# EAGLE schematic KramerMC_CPU_ferryTALE2020 (EAGLE 6.6.0)

## Sheet 1 of 2
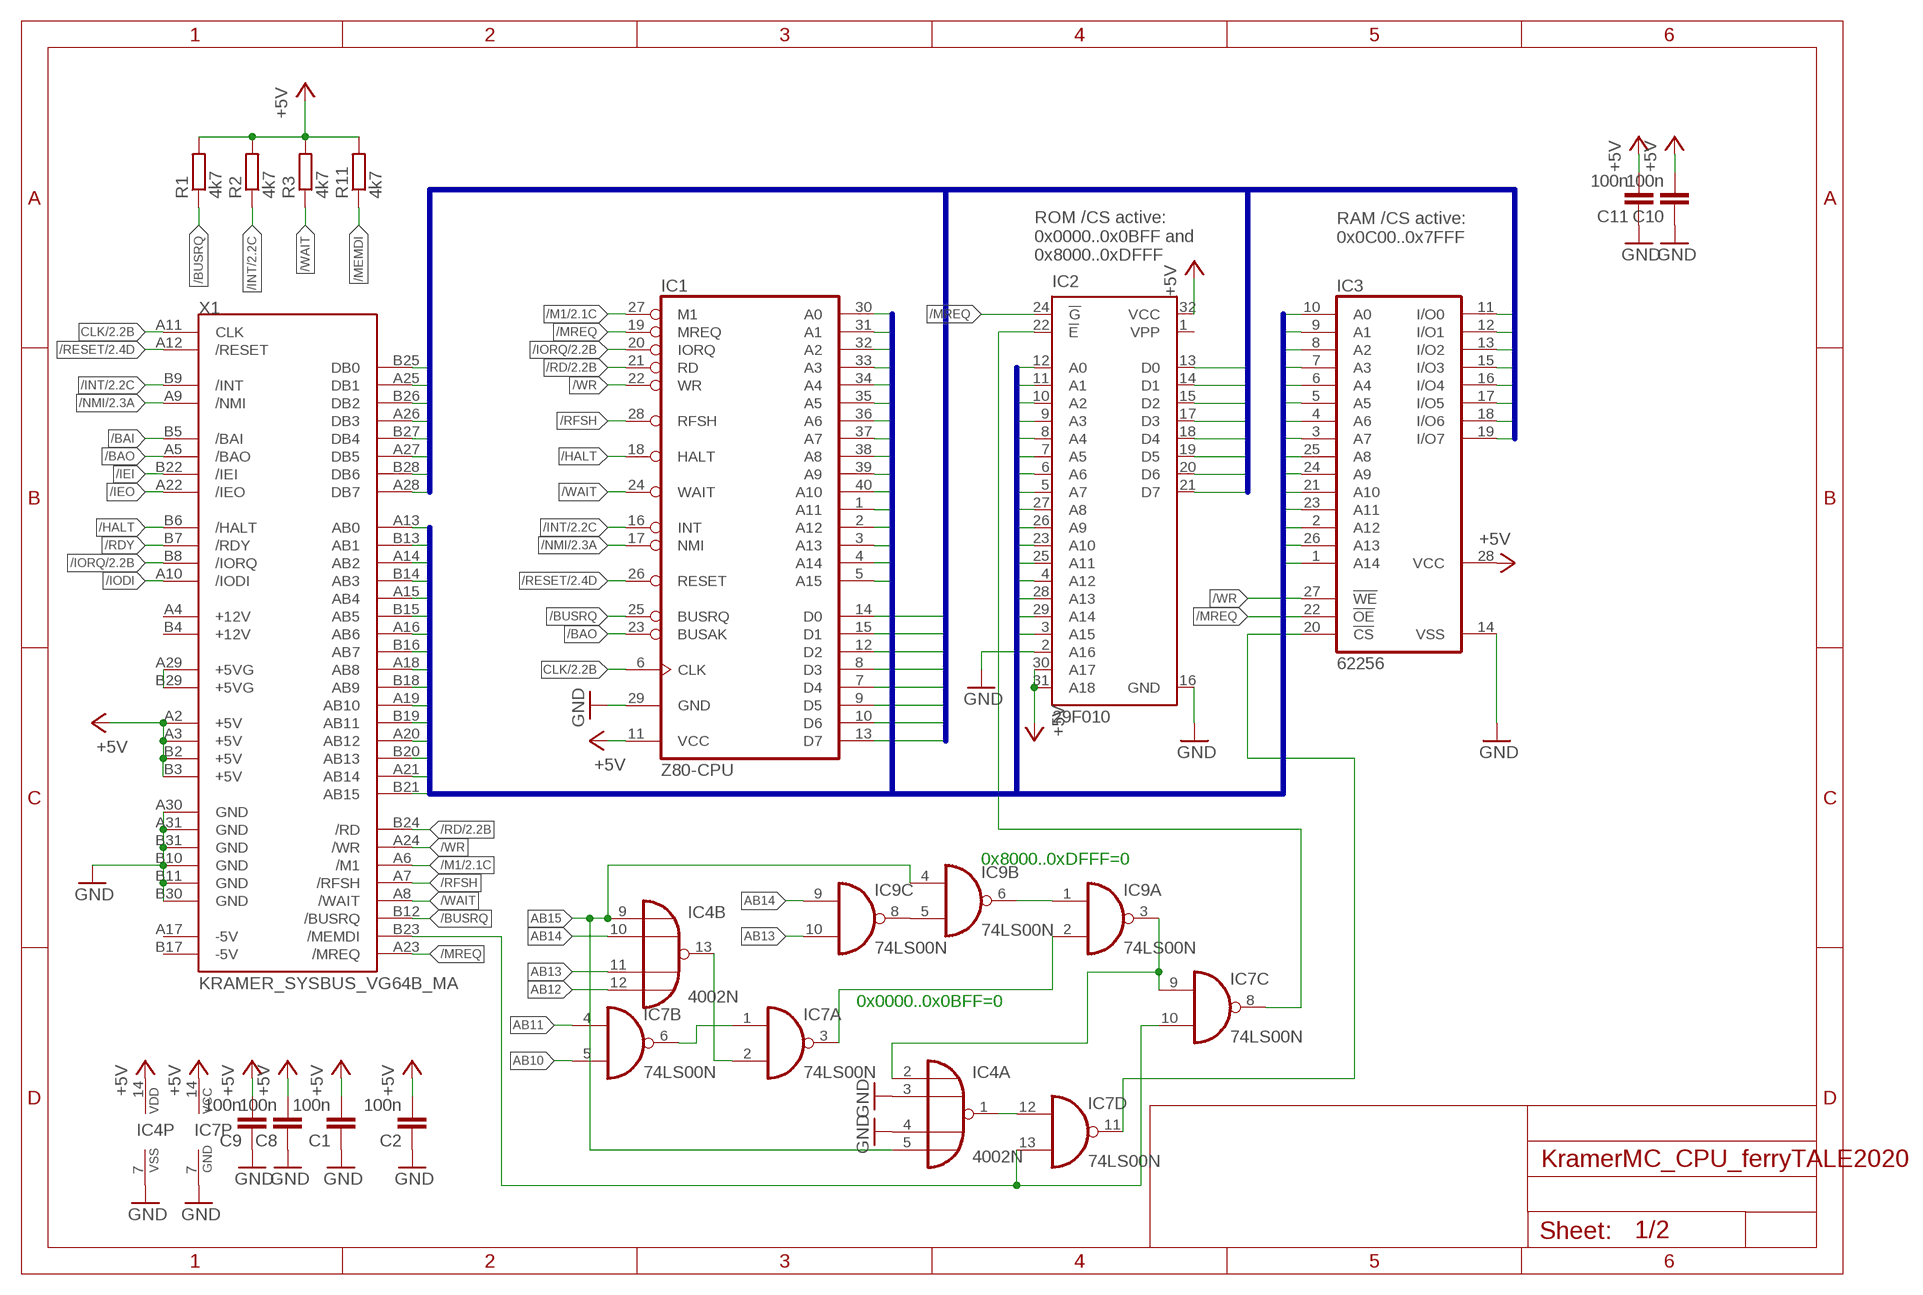
[diagram p0: schematic, sheet 1]

### Parts
C1  100n  C-EUC0603_NEW  [C0603_NEW]
C2  100n  C-EUC0603_NEW  [C0603_NEW]
C8  100n  C-EU050-025X075  [C050-025X075]
C9  100n  C-EU050-024X044  [C050-024X044]
C10  100n  C-EU050-024X044  [C050-024X044]
C11  100n  C-EUC0603_NEW  [C0603_NEW]
IC1  Z80-CPU  Z80CPU  [DIL40]
IC2  29F010  M27C4001B  [DIL32]
IC3  62256  62256P  [DIL28-6]
IC4  4002N  [DIL14]
IC7  74LS00N  [DIL14]
IC9  74LS00N  [DIL14]
R1  4k7  R-EU_R0603_NEW  [R0603_NEW]
R2  4k7  R-EU_0207/10  [0207/10]
R3  4k7  R-EU_R0603_NEW  [R0603_NEW]
R11  4k7  R-EU_R0805_WIDE  [R0805_WIDE]
X1  KRAMER_SYSBUS_VG64B_MA  [MAB64]

### Nets
+5V: C1.2 C2.2 C8.2 C9.2 C10.2 C11.2 IC1.11(VCC) IC2.30(A17) IC2.31(A18) IC2.32(VCC) IC3.28(VCC) IC4.14(P:VDD) IC7.14(P:VCC) R1.2 R2.2 R3.2 R11.2 X1.A2(+5V) X1.A3(+5V) X1.B2(+5V) X1.B3(+5V) ; also sheet 2
+5VG: X1.A29(+5VG) X1.B29(+5VG)
/BAI: X1.B5(/BAI)
/BAO: IC1.23(BUSAK) X1.A5(/BAO)
/BUSRQ: IC1.25(BUSRQ) R1.1 X1.B12(/BUSRQ)
/HALT: IC1.18(HALT) X1.B6(/HALT)
/IEI: X1.B22(/IEI)
/IEO: X1.A22(/IEO)
/INT: IC1.16(INT) R2.1 X1.B9(/INT) ; also sheet 2
/IODI: X1.A10(/IODI)
/IORQ: IC1.20(IORQ) X1.B8(/IORQ) ; also sheet 2
/M1: IC1.27(M1) X1.A6(/M1) ; also sheet 2
/MEMDI: IC7.10(C:I1) IC7.13(D:I1) R11.1 X1.B23(/MEMDI)
/MREQ: IC1.19(MREQ) IC2.24(!G) IC3.22(!OE) X1.A23(/MREQ)
/NMI: IC1.17(NMI) X1.A9(/NMI) ; also sheet 2
/RD: IC1.21(RD) X1.B24(/RD) ; also sheet 2
/RDY: X1.B7(/RDY)
/RESET: IC1.26(RESET) X1.A12(/RESET) ; also sheet 2
/RFSH: IC1.28(RFSH) X1.A7(/RFSH)
/WAIT: IC1.24(WAIT) R3.1 X1.A8(/WAIT)
/WR: IC1.22(WR) IC3.27(!WE) X1.A24(/WR)
AB0: IC1.30(A0) IC2.12(A0) IC3.10(A0) X1.A13(AB0) ; also sheet 2
AB1: IC1.31(A1) IC2.11(A1) IC3.9(A1) X1.B13(AB1) ; also sheet 2
AB2: IC1.32(A2) IC2.10(A2) IC3.8(A2) X1.A14(AB2)
AB3: IC1.33(A3) IC2.9(A3) IC3.7(A3) X1.B14(AB3)
AB4: IC1.34(A4) IC2.8(A4) IC3.6(A4) X1.A15(AB4)
AB5: IC1.35(A5) IC2.7(A5) IC3.5(A5) X1.B15(AB5)
AB6: IC1.36(A6) IC2.6(A6) IC3.4(A6) X1.A16(AB6) ; also sheet 2
AB7: IC1.37(A7) IC2.5(A7) IC3.3(A7) X1.B16(AB7) ; also sheet 2
AB8: IC1.38(A8) IC2.27(A8) IC3.25(A8) X1.A18(AB8)
AB9: IC1.39(A9) IC2.26(A9) IC3.24(A9) X1.B18(AB9)
AB10: IC1.40(A10) IC2.23(A10) IC3.21(A10) IC7.5(B:I1) X1.A19(AB10)
AB11: IC1.1(A11) IC2.25(A11) IC3.23(A11) IC7.4(B:I0) X1.B19(AB11)
AB12: IC1.2(A12) IC2.4(A12) IC3.2(A12) IC4.12(B:I3) X1.A20(AB12)
AB13: IC1.3(A13) IC2.28(A13) IC3.26(A13) IC4.11(B:I2) IC9.10(C:I1) X1.B20(AB13)
AB14: IC1.4(A14) IC2.29(A14) IC3.1(A14) IC4.10(B:I1) IC9.9(C:I0) X1.A21(AB14)
AB15: IC1.5(A15) IC2.3(A15) IC4.5(A:I3) IC4.9(B:I0) IC9.4(B:I0) X1.B21(AB15)
CLK: IC1.6(CLK) X1.A11(CLK) ; also sheet 2
DB0: IC1.14(D0) IC2.13(D0) IC3.11(I/O0) X1.B25(DB0) ; also sheet 2
DB1: IC1.15(D1) IC2.14(D1) IC3.12(I/O1) X1.A25(DB1) ; also sheet 2
DB2: IC1.12(D2) IC2.15(D2) IC3.13(I/O2) X1.B26(DB2) ; also sheet 2
DB3: IC1.8(D3) IC2.17(D3) IC3.15(I/O3) X1.A26(DB3) ; also sheet 2
DB4: IC1.7(D4) IC2.18(D4) IC3.16(I/O4) X1.B27(DB4) ; also sheet 2
DB5: IC1.9(D5) IC2.19(D5) IC3.17(I/O5) X1.A27(DB5) ; also sheet 2
DB6: IC1.10(D6) IC2.20(D6) IC3.18(I/O6) X1.B28(DB6) ; also sheet 2
DB7: IC1.13(D7) IC2.21(D7) IC3.19(I/O7) X1.A28(DB7) ; also sheet 2
GND: C1.1 C2.1 C8.1 C9.1 C10.1 C11.1 IC1.29(GND) IC2.2(A16) IC2.16(GND) IC3.14(VSS) IC4.3(A:I1) IC4.4(A:I2) IC4.7(P:VSS) IC7.7(P:GND) X1.A30(GND) X1.A31(GND) X1.B10(GND) X1.B11(GND) X1.B30(GND) X1.B31(GND) ; also sheet 2
N$1: IC3.20(!CS) IC7.11(D:O)
N$2: IC7.3(A:O) IC9.2(A:I1)
N$3: IC2.22(!E) IC7.8(C:O)
N$4: IC9.5(B:I1) IC9.8(C:O)
N$5: IC9.1(A:I0) IC9.6(B:O)
N$6: IC4.2(A:I0) IC7.9(C:I0) IC9.3(A:O)
N$7: IC4.13(B:O) IC7.2(A:I1)
N$8: IC7.1(A:I0) IC7.6(B:O)
N$186: IC4.1(A:O) IC7.12(D:I0)
Unconnected: X1.A4(+12V) X1.A17(-5V) X1.B4(+12V) X1.B17(-5V)

### Buses
DB
AB

### Notes on the sheet
- RAM /CS active:
  0x0C00..0x7FFF
- ROM /CS active:
  0x0000..0x0BFF and
  0x8000..0xDFFF
- 0x8000..0xDFFF=0
- 0x0000..0x0BFF=0

## Sheet 2 of 2
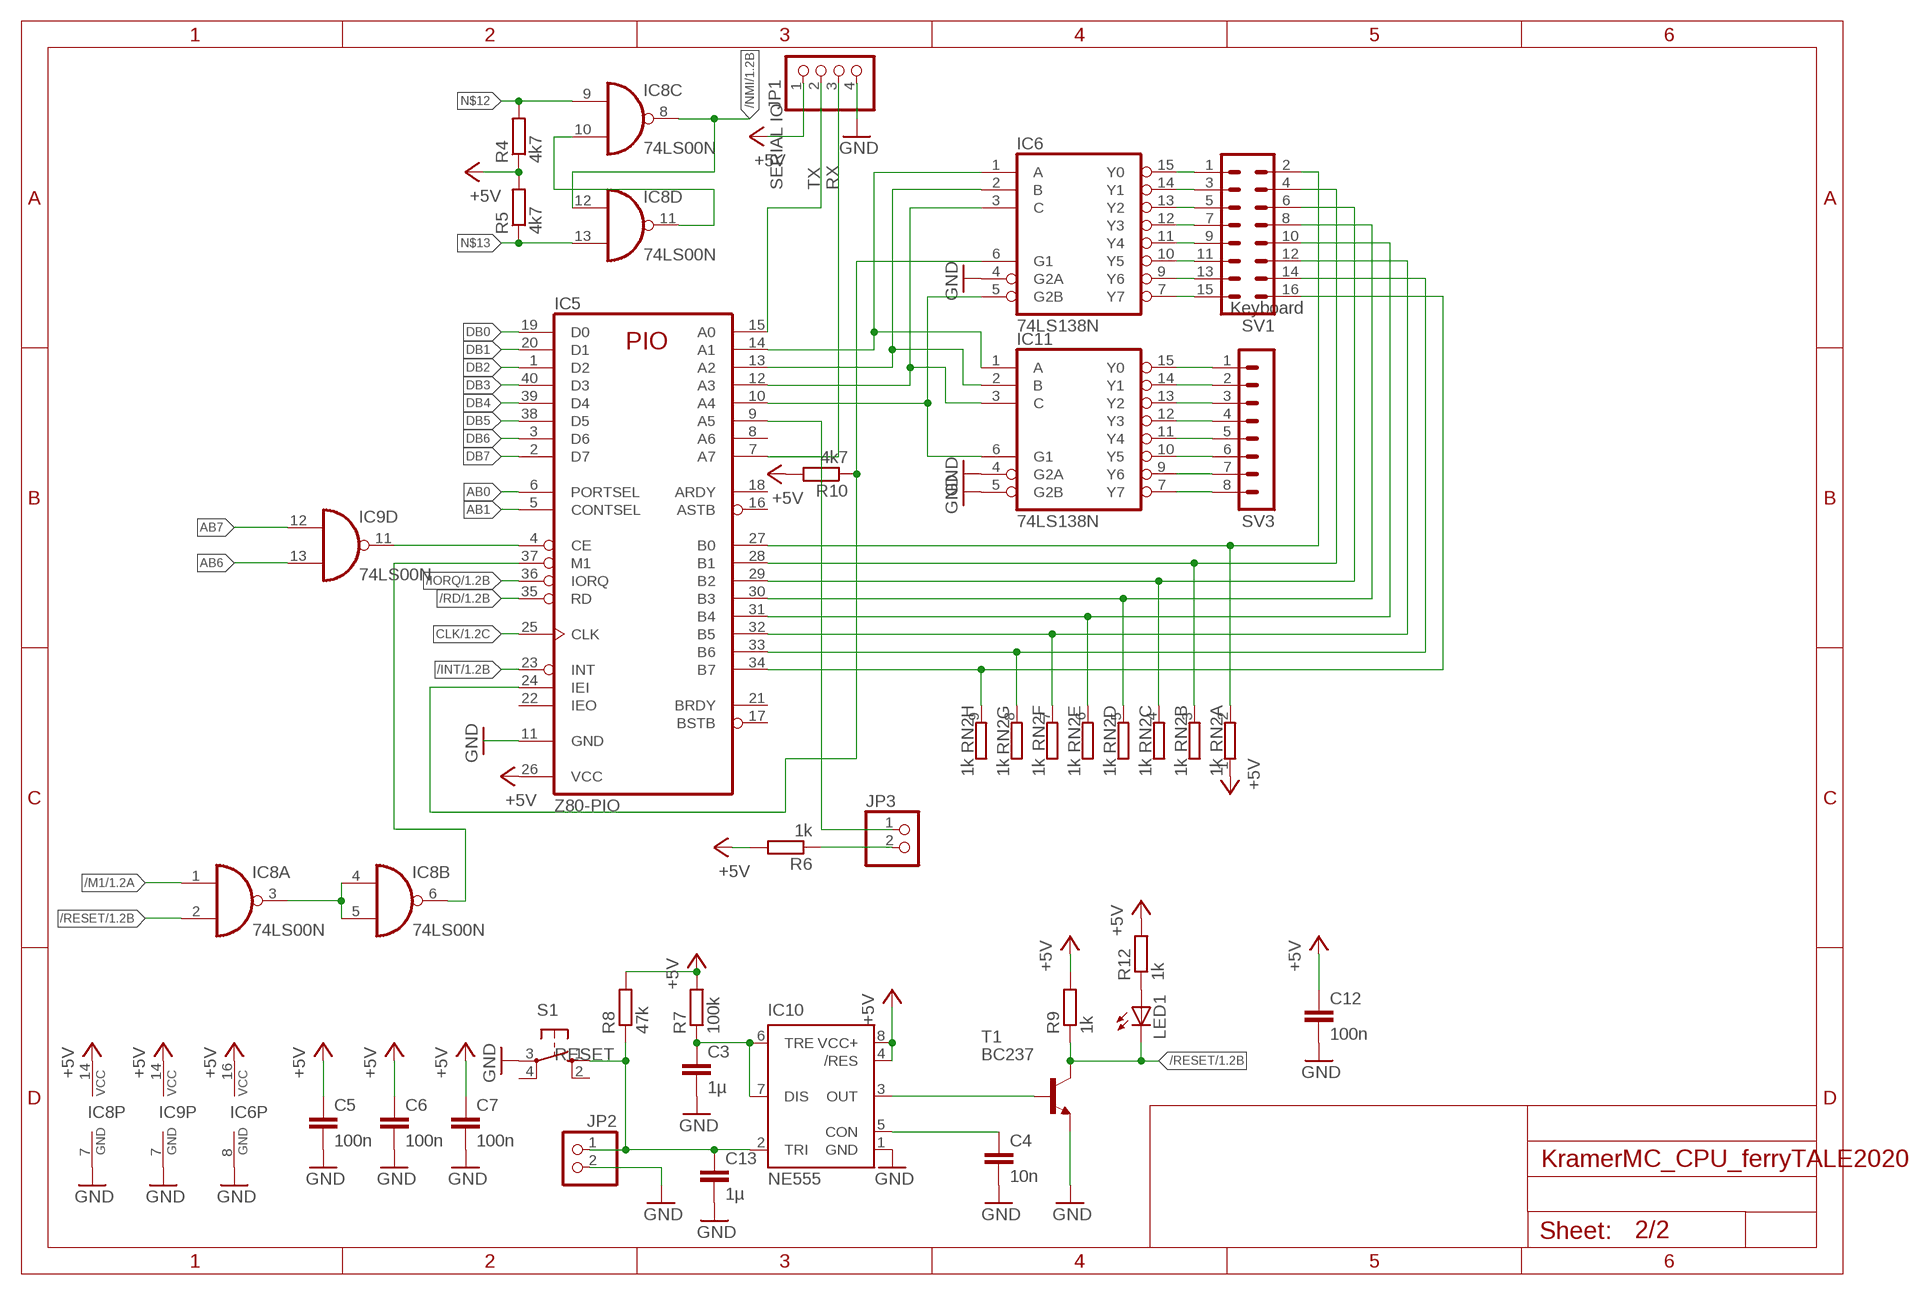
[diagram p1: schematic, sheet 2]

### Parts
C3  1µ  C-EUC0603_NEW  [C0603_NEW]
C4  10n  C-EUC0805  [C0805]
C5  100n  C-EUC0603_NEW  [C0603_NEW]
C6  100n  C-EUC0603_NEW  [C0603_NEW]
C7  100n  C-EUC0603_NEW  [C0603_NEW]
C12  100n  C-EUC0603_NEW  [C0603_NEW]
C13  1µ  C-EUC0603_NEW  [C0603_NEW]
IC5  Z80-PIO  Z80PIO  [DIL40]
IC6  74LS138N  [DIL16]
IC8  74LS00N  [DIL14]
IC10  NE555  [DIL-08]
IC11  74LS138N  [DIL16]
JP1  PINHD-1X4/90  [1X04/90]
JP2  PINHD-1X2/90  [1X02/90]
JP3  PINHD-1X2/90  [1X02/90]
LED1  LED3MM  [LED3MM]
R4  4k7  R-EU_R0805  [R0805]
R5  4k7  R-EU_R0805  [R0805]
R6  1k  R-EU_0207/10  [0207/10]
R7  100k  R-EU_R0603_NEW  [R0603_NEW]
R8  47k  R-EU_R0805  [R0805]
R9  1k  R-EU_R0603_NEW  [R0603_NEW]
R10  4k7  R-EU_0207/7  [0207/7]
R12  1k  R-EU_R0603_NEW  [R0603_NEW]
RN2  1k  GE08R  [SIL9]
S1  10-XX  [B3F-10XX]
SV1  MA08-2W  [MA08-2W]
SV3  MA08-1W  [MA08-1W]
T1  BC237  [TO92]

### Nets
+5V: C5.1 C6.1 C7.1 C12.1 IC5.26(VCC) IC6.16(VCC) IC8.14(P:VCC) IC9.14(P:VCC) IC10.4(/RES) IC10.8(VCC+) JP1.1 R4.1 R5.2 R6.2 R7.2 R8.2 R9.2 R10.2 R12.2 RN2.1 ; also sheet 1
/INT: IC5.23(INT) ; also sheet 1
/IORQ: IC5.36(IORQ) ; also sheet 1
/M1: IC8.1(A:I0) ; also sheet 1
/NMI: IC8.8(C:O) IC8.12(D:I0) ; also sheet 1
/RD: IC5.35(RD) ; also sheet 1
/RESET: IC8.2(A:I1) LED1.K(C) R9.1 T1.3(C) ; also sheet 1
AB0: IC5.6(PORTSEL) ; also sheet 1
AB1: IC5.5(CONTSEL) ; also sheet 1
AB6: IC9.13(D:I1) ; also sheet 1
AB7: IC9.12(D:I0) ; also sheet 1
CLK: IC5.25(CLK) ; also sheet 1
DB0: IC5.19(D0) ; also sheet 1
DB1: IC5.20(D1) ; also sheet 1
DB2: IC5.1(D2) ; also sheet 1
DB3: IC5.40(D3) ; also sheet 1
DB4: IC5.39(D4) ; also sheet 1
DB5: IC5.38(D5) ; also sheet 1
DB6: IC5.3(D6) ; also sheet 1
DB7: IC5.2(D7) ; also sheet 1
GND: C3.2 C4.2 C5.2 C6.2 C7.2 C12.2 C13.2 IC5.11(GND) IC6.4(G2A) IC6.8(GND) IC8.7(P:GND) IC9.7(P:GND) IC10.1(GND) IC11.4(G2A) IC11.5(G2B) JP1.4 JP2.2 S1.3(P) T1.1(E) ; also sheet 1
N$9: LED1.A R12.1
N$10: IC6.15(Y0) SV1.1
N$11: IC8.10(C:I1) IC8.11(D:O)
N$12: IC8.9(C:I0) R4.2
N$13: IC8.13(D:I1) R5.1
N$14: IC5.14(A1) IC6.1(A) IC11.1(A)
N$15: IC5.13(A2) IC6.2(B) IC11.2(B)
N$16: IC5.12(A3) IC6.3(C) IC11.3(C)
N$17: IC8.3(A:O) IC8.4(B:I0) IC8.5(B:I1)
N$18: IC6.14(Y1) SV1.3
N$19: IC5.4(CE) IC9.11(D:O)
N$20: IC5.37(M1) IC8.6(B:O)
N$21: IC6.13(Y2) SV1.5
N$22: IC6.12(Y3) SV1.7
N$23: IC6.11(Y4) SV1.9
N$24: IC6.10(Y5) SV1.11
N$25: IC6.9(Y6) SV1.13
N$26: IC6.7(Y7) SV1.15
N$27: IC5.27(B0) RN2.2 SV1.2
N$28: IC5.28(B1) RN2.3 SV1.4
N$29: IC5.29(B2) RN2.4 SV1.6
N$30: IC5.30(B3) RN2.5 SV1.8
N$31: IC5.31(B4) RN2.6 SV1.10
N$32: IC5.32(B5) RN2.7 SV1.12
N$33: IC5.33(B6) RN2.8 SV1.14
N$34: IC5.34(B7) RN2.9 SV1.16
N$35: IC5.9(A5) JP3.1
N$36: IC10.3(OUT) T1.2(B)
N$37: C3.1 IC10.6(TRE) IC10.7(DIS) R7.1
N$38: C4.1 IC10.5(CON)
N$39: JP3.2 R6.1
N$40: IC5.24(IEI) IC6.6(G1) R10.1
N$276: IC5.10(A4) IC6.5(G2B) IC11.6(G1)
N$283: IC11.15(Y0) SV3.1
N$284: IC11.14(Y1) SV3.2
N$285: IC11.13(Y2) SV3.3
N$286: IC11.12(Y3) SV3.4
N$287: IC11.11(Y4) SV3.5
N$288: IC11.10(Y5) SV3.6
N$301: IC11.9(Y6) SV3.7
N$302: IC11.7(Y7) SV3.8
RESET_BUTTON: C13.1 IC10.2(TRI) JP2.1 R8.1 S1.1(S)
RX: IC5.7(A7) JP1.3
TX: IC5.15(A0) JP1.2
Unconnected: IC5.8(A6) IC5.16(ASTB) IC5.17(BSTB) IC5.18(ARDY) IC5.21(BRDY) IC5.22(IEO) S1.2(S1) S1.4(P1)

### Notes on the sheet
- SERIAL IO
  
  TX
  RX
- Keyboard
- RESET

## Power pins joined to a net without a drawn wire
GND: IC11.8(GND)
VCC: IC11.16(VCC)
VPP: IC2.1(VPP)

## Library data of the parts
C1-C13 = rcl:C-EU: CAPACITOR, European symbol
IC1 = zilog:Z80CPU: Z80 FAMILY DEVICE
IC2 = st-microelectronics:M27C4001: 4 Mbit (512Kb x 8) UV EPROM and OTP EPROM Source: www.st.com .. M27C4001 EPROM 4 MBIT.pdf; MPN: M27C4001-10B1; OC_FARNELL: 3338137; OC_NEWARK: 56P9200
IC3 = memory-hitachi:62256P: MEMORY; OC_FARNELL: unknown; OC_NEWARK: unknown
IC4 = 40xx:4002: 4-input NOR
IC5 = zilog:Z80PIO: Z80 FAMILY DEVICE
IC6 IC11 = 74xx-eu:74*138: 3-line to 8-line DECODER/DEMULTIPLEXER
IC7-IC9 = 74xx-eu:74*00: Quad 2-input NAND gate
IC10 = st-microelectronics:NE555: General purpose bipolar Timer; MF: Arrow Electronics; MPN: NE555N; OC_FARNELL: 1467742; OC_NEWARK: 89K1486
JP1 = pinhead:PINHD-1X4: PIN HEADER
JP2 JP3 = pinhead:PINHD-1X2: PIN HEADER
LED1 = led:LED: LED OSRAM: - CHIPLED LG R971, LG N971, LY N971, LG Q971, LY Q971, LO R971, LY R971 LH N974, LH R974 LS Q976, LO Q976, LY Q976 LO Q996 - Hyper CHIPLED LW Q18S LB Q993, LB Q99A, LB R99A - SideLED LS A670, LO A670, LY A670, LG A670, LP A670 LB A673, LV A673, LT A673, LW A673 LH A674 LY A675 LS A676, LA A676, LO A676, LY A676, LW A676 LS A679, LY A679, LG A679 - Hyper Micro SIDELED® LS Y876, LA Y876, LO Y876, LY Y876 LT Y87S - SmartLED LW L88C, LW L88S LB L89C, LB L89S, LG L890 LS L89K, LO L89K, LY L89K LS L896, LA L896, LO L896, LY L896 - TOPLED LS T670, LO T670, LY T670, LG T670, LP T670 LSG T670, LSP T670, LSY T670, LOP T670, LYG T670 LG T671, LOG T671, LSG T671 LB T673, LV T673, LT T673, LW T673 LH T674 LS T676, LA T676, LO T676, LY T676, LB T676, LH T676, LSB T676, LW T676 LB T67C, LV T67C, LT T67C, LS T67K, LO T67K, LY T67K, LW E67C LS E67B, LA E67B, LO E67B, LY E67B, LB E67C, LV E67C, LT E67C LW T67C LS T679, LY T679, LG T679 LS T770, LO T770, LY T770, LG T770, LP T770 LB T773, LV T773, LT T773, LW T773 LH T774 LS E675, LA E675, LY E675, LS T675 LS T776, LA T776, LO T776, LY T776, LB T776 LHGB T686 LT T68C, LB T68C - Hyper Mini TOPLED® LB M676 - Mini TOPLED Santana® LG M470 LS M47K, LO M47K, LY M47K Source: http://www.osram.convergy.de LUXEON: - LUMILED® LXK2-PW12-R00, LXK2-PW12-S00, LXK2-PW14-U00, LXK2-PW14-V00 LXK2-PM12-R00, LXK2-PM12-S00, LXK2-PM14-U00 LXK2-PE12-Q00, LXK2-PE12-R00, LXK2-PE12-S00, LXK2-PE14-T00, LXK2-PE14-U00 LXK2-PB12-K00, LXK2-PB12-L00, LXK2-PB12-M00, LXK2-PB14-N00, LXK2-PB14-P00, LXK2-PB14-Q00 LXK2-PR12-L00, LXK2-PR12-M00, LXK2-PR14-Q00, LXK2-PR14-R00 LXK2-PD12-Q00, LXK2-PD12-R00, LXK2-PD12-S00 LXK2-PH12-R00, LXK2-PH12-S00 LXK2-PL12-P00, LXK2-PL12-Q00, LXK2-PL12-R00 Source: www.luxeon.com KINGBRIGHT: KA-3528ASYC Source: www.kingbright.com
R1-R12 = rcl:R-EU_: RESISTOR, European symbol
RN2 = resistor-sil:GE08R: SIL RESISTOR; OC_FARNELL: unknown; OC_NEWARK: unknown
S1 = switch-omron:10-XX: OMRON SWITCH; MPN: B3F-1000; OC_FARNELL: 176432; OC_NEWARK: 36M3542
SV1 = con-lstb:MA08-2W: PIN HEADER; OC_FARNELL: unknown; OC_NEWARK: unknown
SV3 = con-lstb:MA08-1W: PIN HEADER; OC_FARNELL: unknown; OC_NEWARK: unknown
T1 = transistor:BC237: NPN TRANSISTOR
X1 = ferry_Kramer_KC:KRAMER_SYSBUS: Kramer Kleincomputer System-Bus Buchse (auf den Modulen verwenden)